# Altium project timer-v1.PrjPcb
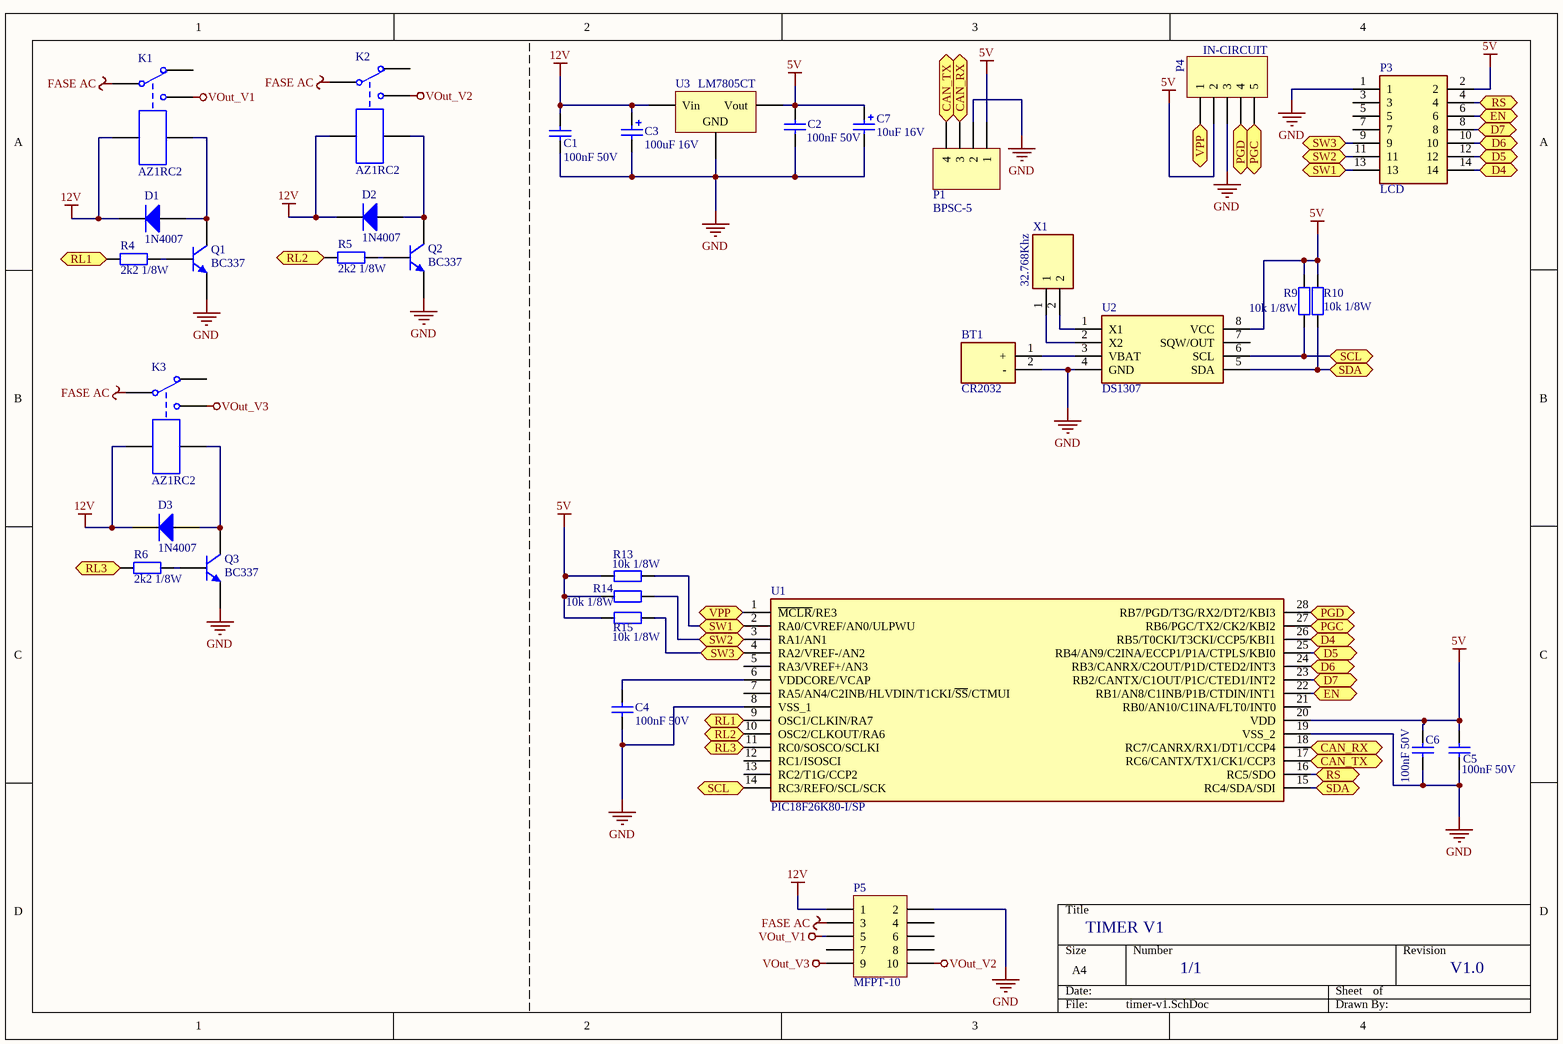
[diagram p0: timer-v1.SchDoc]
1 sheet, 33 parts. Net scope: flat (ports and power ports of the same name join across sheets).
Board file: timer-v1.PcbDoc

## Sheet timer-v1.SchDoc
size A4

### Parts
BT1  CR2032  [CR2032]
C1  100nF 50V  [CAPACITOR_CERAMICO_5MM]
C2  100nF 50V  [CAPACITOR_CERAMICO_5MM]
C3  100uF 16V  [RADIAL_5.00X12.00X2.00]
C4  100nF 50V  [CAPACITOR_CERAMICO_5MM]
C5  100nF 50V  [CAPACITOR_CERAMICO_5MM]
C6  100nF 50V  [CAPACITOR_CERAMICO_5MM]
C7  10uF 16V  [RADIAL_5.00X12.00X2.00]
D1  1N4007  [DO-41]
D2  1N4007  [DO-41]
D3  1N4007  [DO-41]
K1  AZ1RC2  [RELE SPDT]
K2  AZ1RC2  [RELE SPDT]
K3  AZ1RC2  [RELE SPDT]
P1  BPSC-5  [BPSC-4]
P3  LCD  [Header 14 pinos]
P4  IN-CIRCUIT  [BPSC-5]
P5  MFPT-10  [MFPT-10]
Q1  BC337  [TO-92A]
Q2  BC337  [TO-92A]
Q3  BC337  [TO-92A]
R4  2k2 1/8W  [RESISTOR_CR16]
R5  2k2 1/8W  [RESISTOR_CR16]
R6  2k2 1/8W  [RESISTOR_CR16]
R9  10k 1/8W  [RES CR16]
R10  10k 1/8W  [RES CR16]
R13  10k 1/8W  [RES CR16]
R14  10k 1/8W  [RES CR16]
R15  10k 1/8W  [RES CR16]
U1  PIC18F26K80-I/SP  [SPDIP300-SP28]
U2  DS1307  [DS1307]
U3  LM7805CT  [TO220_90]
X1  32.768Khz  [CRISTAL 32Khz]

### Ports
CAN_RX, CAN_TX, D4, D5, D6, D7, EN, PGC, PGD, RL1, RL2, RL3, RS, SCL, SDA, SW1, SW2, SW3, VPP

### Nets
5V: C2.2 C5.2 C6.2 C7.1 P1.1 P3.2 P4.2 R9.2 R10.2 R13.1 R14.1 R15.1 U1.20(VDD) U2.8(VCC) U3.3(Vout)
12V: C1.2 C3.1 D1.2(K) D2.2(K) D3.2(K) K1.4 K2.4 K3.4 P5.1 U3.1(Vin)
FASE AC: K1.1(Comum) K2.1(Comum) K3.1(Comum) P5.3
GND: BT1.2(-) C1.1 C2.1 C3.2 C4.1 C5.1 C6.1 C7.2 P1.2 P3.1 P4.3 P5.2 Q1.3(E) Q2.3(E) Q3.3(E) U1.8(VSS_1) U1.19(VSS_2) U2.4(GND) U3.2(GND)
VOut_V1: K1.2(N.A.) P5.5
VOut_V2: K2.2(N.A.) P5.10
VOut_V3: K3.2(N.A.) P5.9
NetBT1_1: BT1.1(+) U2.3(VBAT)
NetC4_2: C4.2 U1.6(VDDCORE/VCAP)
NetD1_1: D1.1(A) K1.5 Q1.1(C)
NetD2_1: D2.1(A) K2.5 Q2.1(C)
NetD3_1: D3.1(A) K3.5 Q3.1(C)
NetP1_3: P1.3 U1.18(RC7/CANRX/RX1/DT1/CCP4) ; port CAN_RX
NetP1_4: P1.4 U1.17(RC6/CANTX/TX1/CK1/CCP3) ; port CAN_TX
NetP3_4: P3.4 U1.16(RC5/SDO) ; port RS
NetP3_6: P3.6 U1.22(RB1/AN8/C1INB/P1B/CTDIN/INT1) ; port EN
NetP3_8: P3.8 U1.23(RB2/CANTX/C1OUT/P1C/CTED1/INT2) ; port D7
NetP3_9: P3.9 R15.2 U1.4(RA2/VREF-/AN2) ; port SW3
NetP3_10: P3.10 U1.24(RB3/CANRX/C2OUT/P1D/CTED2/INT3) ; port D6
NetP3_11: P3.11 R14.2 U1.3(RA1/AN1) ; port SW2
NetP3_12: P3.12 U1.25(RB4/AN9/C2INA/ECCP1/P1A/CTPLS/KBI0) ; port D5
NetP3_13: P3.13 R13.2 U1.2(RA0/CVREF/AN0/ULPWU) ; port SW1
NetP3_14: P3.14 U1.26(RB5/T0CKI/T3CKI/CCP5/KBI1) ; port D4
NetP4_1: P4.1 U1.1(~{MCLR}/RE3) ; port VPP
NetP4_4: P4.4 U1.28(RB7/PGD/T3G/RX2/DT2/KBI3) ; port PGD
NetP4_5: P4.5 U1.27(RB6/PGC/TX2/CK2/KBI2) ; port PGC
NetQ1_2: Q1.2(B) R4.2
NetQ2_2: Q2.2(B) R5.2
NetQ3_2: Q3.2(B) R6.2
NetR4_1: R4.1 U1.9(OSC1/CLKIN/RA7) ; port RL1
NetR5_1: R5.1 U1.10(OSC2/CLKOUT/RA6) ; port RL2
NetR6_1: R6.1 U1.11(RC0/SOSCO/SCLKI) ; port RL3
NetR9_1: R9.1 U1.14(RC3/REFO/SCL/SCK) U2.6(SCL) ; port SCL
NetR10_1: R10.1 U1.15(RC4/SDA/SDI) U2.5(SDA) ; port SDA
NetU2_1: U2.1(X1) X1.2
NetU2_2: U2.2(X2) X1.1

Not connected (* = marked no-connect by the designer): K1 3(N.F.); K2 3(N.F.); K3 3(N.F.); P3 3 5 7; P5 4 6 7 8; U1 5(RA3/VREF+/AN3) 7(RA5/AN4/C2INB/HLVDIN/T1CKI/~{SS}/CTMUI) 12(RC1/ISOSCI) 13(RC2/T1G/CCP2) 21(RB0/AN10/C1INA/FLT0/INT0); U2 7(SQW/OUT)

### Notes on the sheet
- TIMER V1
- 1/1
- V1.0

### Library data of the parts
BT1 = CR2032 BS-7
C1 C2 C4-C6 = Cap 100nF 50V: CAP CER 0.1UF 50V 10% RADIAL; Manufacturer: TDK Corporation; Manufacturer Part Number: FK28X7R1H104K; Capacitance: 0.1µF; Temperature Coefficient: X7R; Supplier 1: Digi-Key; Supplier Part Number 1: 445-5258-ND; RoHS: RoHS Compliant; Category: Capacitors; Stock 1: 9266; Pricing 1: 1=0.3, 10=0.204, 100=0.1156, 250=0.0918, 500=0.0816, 1000=0.06999, 5000=0.06166, 10000=0.05833, 25000=0.05333 (USD); Packaging: Bulk; Tolerance: ±10%; Voltage - Rated: 50V; Mounting Type: Through Hole; Operating Temperature: -55°C ~ 125°C; Applications: General Purpose; Ratings: -; Package / Case: Radial; Size / Dimension: 0.157" L x 0.098" W (4.00mm x 2.50mm); Height - Seated (Max): 0.217" (5.50mm); Thickness (Max): -; Lead Spacing: 0.197" (5.00mm); Features: -; Lead Style: Formed Leads - Kinked; ComponentLink1URL: http://product.tdk.com/capacitor/leadmlcc/en/documents/leadmlcc_commercial_general_en.pdf; ComponentLink1Description: http://product.tdk.com/capacitor/leadmlcc/en/documents/leadmlcc_commercial_general_en.pdf
C3 C7 = Cap 10uF 16V: CAP ALUM 10UF 20% 16V RADIAL; Manufacturer: Panasonic Electronic Components; Manufacturer Part Number: ECA-1CM100; Capacitance: 10µF; Lifetime @ Temp.: 2000 Hrs @ 85°C; Ripple Current: 30mA; Supplier 1: Digi-Key; Supplier Part Number 1: P5134-ND; RoHS: RoHS Compliant; Category: Capacitors; Stock 1: 18099; Pricing 1: 1=0.2, 50=0.0806, 100=0.068, 500=0.04654, 1000=0.04117, 5000=0.0358, 10000=0.03401, 25000=0.03043 (USD); Packaging: Bulk; Tolerance: ±20%; Voltage Rating: 16V; ESR (Equivalent Series Resistance): -; Operating Temperature: -40°C ~ 85°C; Type: -; Applications: General Purpose; Impedance: -; Lead Spacing: 0.079" (2.00mm); Size / Dimension: 0.197" Dia (5.00mm); Height - Seated (Max): 0.472" (12.00mm); Surface Mount Land Size: -; Mounting Type: Through Hole; Package / Case: Radial, Can; ComponentLink1URL: http://industrial.panasonic.com/www-cgi/jvcr13pz.cgi?E+PZ+3+ABA0012+ECA1CM100+7+WW; ComponentLink1Description: http://industrial.panasonic.com/www-cgi/jvcr13pz.cgi?E+PZ+3+ABA0012+ECA1CM100+7+WW
D1-D3 = Diodo 1N4007: DIODE GEN PURP 1KV 1A DO41; Manufacturer: Diodes Incorporated; Manufacturer Part Number: 1N4007G-T; Código: 2; Montagem: PTH; Diode Type: Standard; Voltage - Forward (Vf) (Max) @ If: 1V @ 1A; Speed: Standard Recovery >500ns, > 200mA (Io); Current - Reverse Leakage @ Vr: 5µA @ 1000V; Capacitance @ Vr, F: 8pF @ 4V, 1MHz; Supplier 1: Digi-Key; Supplier Part Number 1: 1N4007GDICT-ND; RoHS: RoHS Compliant; Category: Discrete Semiconductor Products; Stock 1: 46214; Pricing 1: 1=0.4, 10=0.299, 100=0.1694, 500=0.11216, 1000=0.08599 (USD); Packaging: Cut Tape (CT); Part Status: Active; Current - Average Rectified (Io): 1A; Mounting Type: Through Hole; Package / Case: DO-204AL, DO-41, Axial; Supplier Device Package: DO-41; Operating Temperature - Junction: -65°C ~ 175°C; ComponentLink1URL: https://www.diodes.com/assets/Datasheets/ds29002.pdf; ComponentLink1Description: https://www.diodes.com/assets/Datasheets/ds29002.pdf; Supplier 2: Digi-Key; Supplier Part Number 2: RGP30K-E3/73-ND; Stock 2: 0; Pricing 2: 2000=0.38779 (USD); Base Part Number: RGP30K; ComponentLink2URL: http://www.vishay.com/docs/88704/rgp30a.pdf; ComponentLink2Description: http://www.vishay.com/docs/88704/rgp30a.pdf
K1-K3 = Rele AZ1RC2: RELAY GEN PURPOSE SPDT 10A 12V; Manufacturer: Metaltex; Relay Type: General Purpose; Coil Type: Non Latching; Coil Voltage: 12VDC; Contact Form: SPDT (1 Form C); Switching Voltage: 250VAC, 30VDC - Max; Turn On Voltage (Max): 9 VDC; Turn Off Voltage (Min): 1.2 VDC; Coil Power: 360 mW; Coil Resistance: 400 Ohms; Montagem: PTH; Código: 2567; Supplier 1: Digi-Key; Supplier Part Number 1: Z1012-ND; Manufacturer Part Number: AZ1RC2; RoHS: RoHS Compliant; Category: Relays; Stock 1: 37370; Pricing 1: 1=1.33, 10=1.247, 25=1.108, 50=1.0526, 100=0.9972, 250=0.8864, 500=0.831 (USD); Packaging: Tray; Part Status: Active; Mounting Type: Through Hole; Termination Style: PC Pin; Contact Material: Silver Tin Oxide (AgSnO); Operating Temperature: -40°C ~ 85°C; ComponentLink1URL: http://www.metaltex.com.br/downloads/AZ.pdf; ComponentLink1Description: http://www.metaltex.com.br/downloads/AZ.pdf
P1 = Barra de pinos simples 180º, 4 pinos: CONN HEADER 4POS 2.54MM VERT; Manufacturer: Molex Inc.; Manufacturer Part Number: 0022284040; Connector Type: Header, Unshrouded, Breakaway; Number of Positions: 4; Number of Positions Loaded: All; Pitch: 0.100" (2.54mm); Supplier 1: Digi-Key; Supplier Part Number 1: WM50014-04-ND; RoHS: RoHS Compliant; Category: Connectors, Interconnects; Stock 1: 418; Pricing 1: 1=0.25, 10=0.22, 100=0.1811, 500=0.14314, 1000=0.12288, 5000=0.1121, 10000=0.10779 (USD); Packaging: Bulk; Contact Type: Male Pin; Number of Rows: 1; Row Spacing: -; Contact Mating Length: 0.240" (6.10mm); Mounting Type: Through Hole; Termination: Solder; Fastening Type: -; Features: -; Contact Finish: Tin; Contact Finish Thickness: 100µin (2.54µm); Color: Black; ComponentLink1URL: http://www.molex.com/pdm_docs/sd/022284040_sd.pdf; ComponentLink1Description: http://www.molex.com/pdm_docs/sd/022284040_sd.pdf
P3 = HEADER - 14P 180º: IDCS-14; Descrição: IDCS Metaltex; DataSheet: https://www.metaltex.com.br/assets/produtos/pdf/idc.pdf
P4 = Barra de pinos simples 180º, 5 pinos: CONN HEADER 5POS 2.54MM VERT; Manufacturer: Molex Inc; Manufacturer Part Number: 0022284050; Connector Type: Header, Unshrouded, Breakaway; Number of Positions: 5; Number of Positions Loaded: All; Pitch: 0.100" (2.54mm); Supplier 1: Digi-Key; Supplier Part Number 1: WM50014-05-ND; RoHS: RoHS Compliant; Category: Connectors, Interconnects; Stock 1: 0; Pricing 1: 1=0.27, 10=0.24, 100=0.1976, 500=0.15622, 1000=0.13411, 5000=0.12234, 10000=0.11764 (USD); Packaging: Bulk; Contact Type: Male Pin; Number of Rows: 1; Row Spacing: -; Contact Mating Length: 0.240" (6.10mm); Mounting Type: Through Hole; Termination: Solder; Fastening Type: -; Features: -; Contact Finish: Tin; Contact Finish Thickness: 100µin (2.54µm); Color: Black; ComponentLink1URL: http://www.molex.com/pdm_docs/sd/022284050_sd.pdf; ComponentLink1Description: http://www.molex.com/pdm_docs/sd/022284050_sd.pdf
P5 = MFPT-10: MINI FIT - Conector modular miniatura; Capacidade do contato: 7A; Tensão de operação máx.: 250VAC/VCC; Resistência de contato inicial máx.: 20M; Resistência de isolação: 1000M (500VCC); Temperatura de operação: -25 ~ 85ºC; Material do isolador: PA 66 UL94V-2; Material dos terminais dos conectores de PCI: Latão estanhado; Bitola aplicável de cabo para os terminais de crimpar: 22 ~ 18 AWG (0,3mm2 ~ 0,75mm2 ); Rigidez dielétrica: 1500 VCA / VAC (1minuto / minute); DataSheet: www.metaltex.com.br/assets/produtos/pdf/mf.pdf; Terminal fêmea para cabos AWG: MFTF-1822
Q1-Q3 = Transistor NPN BC337: TRANSISTOR NPN 45V 800MA TO-92; Manufacturer: Fairchild Semiconductor; Manufacturer Part Number: BC33725TA; Vce Saturation (Max) @ Ib, Ic: 700mV @ 50mA, 500mA; Current - Collector Cutoff (Max): 100nA; DC Current Gain (hFE) (Min) @ Ic, Vce: 160 @ 100mA, 1V; Power - Max: 625mW; Frequency - Transition: 100MHz; Supplier 1: Digi-Key; Supplier Part Number 1: BC33725TACT-ND; RoHS: RoHS Compliant; Category: Discrete Semiconductor Products; Stock 1: 10445; Pricing 1: 1=0.23, 10=0.21, 25=0.1512, 100=0.1175, 250=0.07384, 500=0.06292, 1000=0.04287 (USD); Packaging: Cut Tape (CT); Transistor Type: NPN; Current - Collector (Ic) (Max): 800mA; Voltage - Collector Emitter Breakdown (Max): 45V; Mounting Type: Through Hole; Package / Case: TO-226-3, TO-92-3 (TO-226AA) Formed Leads; Supplier Device Package: TO-92-3; ComponentLink1URL: http://www.fairchildsemi.com/datasheets/BC/BC337.pdf; ComponentLink1Description: http://www.fairchildsemi.com/datasheets/BC/BC337.pdf
R4-R6 = Res 2k2 1/8W 5%: RES 2K2 OHM 1/8W 5% AXIAL CARBON FILM; Manufacturer: Stackpole Electronics Inc.; Manufacturer Part Number: CF18JT2K20; Resistance (Ohms): 2.2k; Power (Watts): 0.125W, 1/8W; Temperature Coefficient: 0/ -400ppm/°C; Supplier 1: Digi-Key; Supplier Part Number 1: CF18JT2K20CT-ND; RoHS: RoHS Compliant; Category: Resistors; Stock 1: 61435; Pricing 1: 1=0.1, 10=0.065, 50=0.0356, 100=0.0271, 250=0.02016, 500=0.01488, 1000=0.00992, 2500=0.00837 (USD); Packaging: Cut Tape (CT); Tolerance: ±5%; Composition: Carbon Film; Features: Flame Retardant Coating, Safety; Operating Temperature: -55°C ~ 155°C; Package / Case: Axial; Supplier Device Package: Axial; Size / Dimension: 0.067" Dia x 0.130" L (1.70mm x 3.30mm); Height: -; Number of Terminations: 2; ComponentLink1URL: http://www.seielect.com/catalog/SEI-CF_CFM.pdf; ComponentLink1Description: http://www.seielect.com/catalog/SEI-CF_CFM.pdf
R9 R10 R13-R15 = Res 10k 1/8W 5% CR16: RES 10K OHM 1/8W 5% AXIAL; Manufacturer: Stackpole Electronics Inc.; Manufacturer Part Number: CF18JT10K0; Montagem: PTH; Código: 255; Power (Watts): 0.125W, 1/8W; Temperature Coefficient: 0/ -500ppm/°C; Supplier 1: Digi-Key; Supplier Part Number 1: CF18JT10K0CT-ND; RoHS: RoHS Compliant; Category: Resistors; Stock 1: 291940; Pricing 1: 1=0.1, 10=0.049, 25=0.036, 50=0.0272, 100=0.0201, 250=0.01536, 500=0.01228, 1000=0.00904 (USD); Packaging: Cut Tape (CT); Part Status: Active; Tolerance: ±5%; Composition: Carbon Film; Features: Flame Retardant Coating, Safety; Operating Temperature: -55°C ~ 155°C; Package / Case: Axial; Supplier Device Package: Axial; Size / Dimension: 0.067" Dia x 0.130" L (1.70mm x 3.30mm); Height - Seated (Max): -; Failure Rate: -; ComponentLink1URL: https://www.seielect.com/Catalog/SEI-CF_CFM.pdf; ComponentLink1Description: https://www.seielect.com/Catalog/SEI-CF_CFM.pdf
U2 = DS1307: I2C Real-Time Clock; Supply Voltage: 5V; Package: PDIP-8
U3 = LM7805: IC REG LDO 5V 1A TO220-3; Manufacturer: Fairchild Semiconductor; Manufacturer Part Number: LM7805ACT; Regulator Topology: Positive Fixed; Voltage - Dropout (Typical): 2V @ 1A; Number of Regulators: 1; Voltage - Input: Up to 35V; Supplier 1: Digi-Key; Supplier Part Number 1: LM7805ACT-ND; RoHS: RoHS Compliant; Category: Integrated Circuits (ICs); Stock 1: 6704; Pricing 1: 1=0.67, 10=0.566, 25=0.4956, 100=0.4248, 250=0.36816, 500=0.31152, 1000=0.24072, 2500=0.21948, 5000=0.20532 (USD); Packaging: Tube; Voltage - Output: 5V; Current - Output: 1A; Current - Limit (Min): -; Operating Temperature: 0°C ~ 125°C; Mounting Type: Through Hole; Package / Case: TO-220-3; Supplier Device Package: TO-220-3; ComponentLink1URL: http://www.fairchildsemi.com/datasheets/LM/LM7805.pdf; ComponentLink1Description: http://www.fairchildsemi.com/datasheets/LM/LM7805.pdf
X1 = CRISTAL 32Khz: CRISTAL 32.768 Khz Cilindro